# Altium schematic sheet MicroSDcard.SchDoc
size A4; SheetNumber: 6; SheetTotal: 13
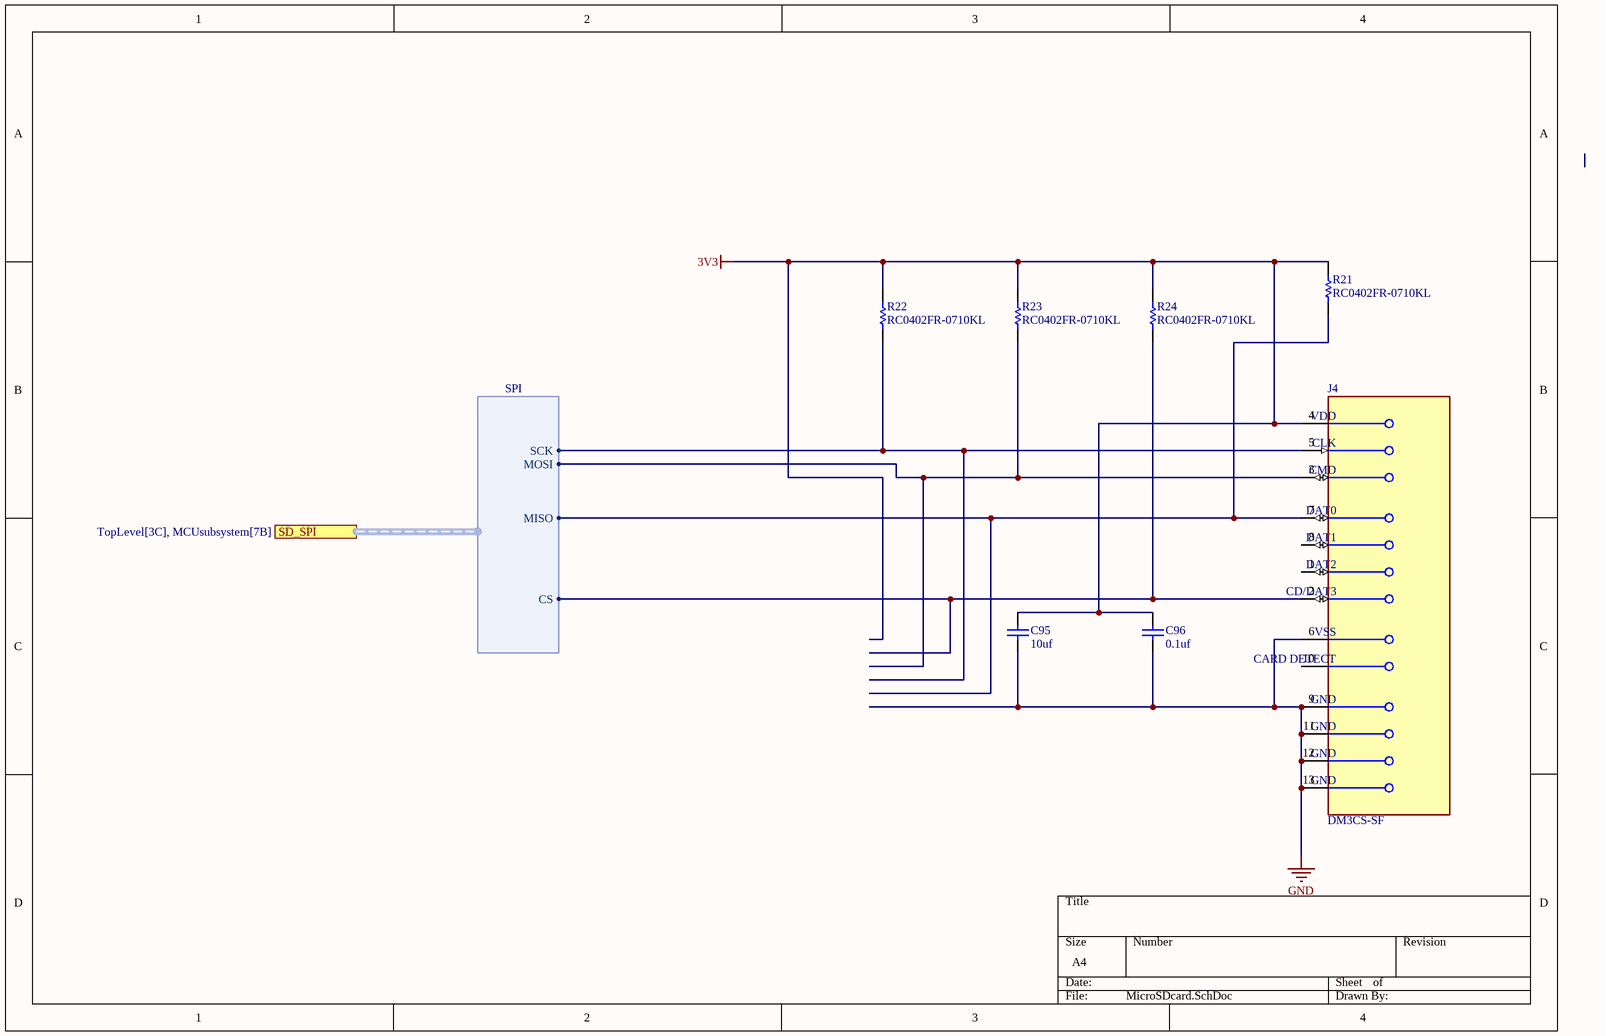
[diagram p0: MicroSDcard.SchDoc]

## Parts
C95  10uf  [CAPC1005X56X25NL10T15]
C96  0.1uf  [CAPC1608X90X35LL15T15]
J4  DM3CS-SF  [FP-DM3CS-SF-MFG]
R21  RC0402FR-0710KL  [RESC1005X40X25LL05T10]
R22  RC0402FR-0710KL  [RESC1005X40X25LL05T10]
R23  RC0402FR-0710KL  [RESC1005X40X25LL05T10]
R24  RC0402FR-0710KL  [RESC1005X40X25LL05T10]

## Ports
SD_SPI (harness SPI, see TopLevel[3C], MCUsubsystem[7B])

## Harnesses
SPI: SCK, MISO, MOSI, CS

## Nets
3V3: C95.1 C96.2 J4.4(VDD) R21.2 R22.2 R23.2 R24.2
GND: C95.2 C96.1 J4.6(VSS) J4.9(GND) J4.11(GND) J4.12(GND) J4.13(GND)
NetJ4_2: J4.2(CD/DAT3) R24.1 ; port SD_SPI.CS
NetJ4_3: J4.3(CMD) R23.1 ; port SD_SPI.MOSI
NetJ4_5: J4.5(CLK) R22.1 ; port SD_SPI.SCK
NetJ4_7: J4.7(DAT0) R21.1 ; port SD_SPI.MISO

Not connected (* = marked no-connect by the designer): J4 1(DAT2) 8(DAT1) 10(CARD_DETECT)

## Library data of the parts
C95 = CMP-2008-02890-1: Part Number: 0402ZD225MAT2A; Manufacturer: AVX Interconnect / Elco
C96 = CMP-2006-04199-2: Chip Capacitor, 100 nF, 25 V, -30 to 85 degC, 0603 (1608 Metric), RoHS, Tape and Reel; Manufacturer: AVX; Dielectric: Y5V; Rated Voltage: 25V; Tolerance (%): -20to+80%; Capacitance: 100nF; Datasheet Version: 01/2010; Package Description: 2-Pin Surface Mount Device, Body 1.6 x 0.8 mm; Manufacturer URL: http://www.avx.com/; Datasheet URL: http://datasheet.octopart.com/06033G104ZAT2A-AVX-datasheet-8445862.pdf; Package Reference: 0603; Case Size/Dimension: 0603; Mounting Technology: SurfaceMount
J4 = CMP-11597-000003-1: CONN MICRO SD CARD HINGED TYPE; Pitch: 1.1mm; Connector Type: Connector; Current Rating: 500mA; Voltage Rating (AC): 125V; Gender: Female; Insulation Resistance: 1GR; Number of Positions: 8; Contact Resistance: 100mR; Packaging: Tape and Reel; Flammability Rating: UL94 V-0; Lead Free: Lead Free; Min Operating Temperature: -25°C; Orientation: Right Angle; Width: 13.8mm; Number of Rows: 1; Housing Material: Polymer; Package Quantity: 1; Mount: Surface Mount; Max Current Rating: 500mA; Radiation Hardening: No; Max Operating Temperature: 85°C; Contact Plating: Gold; Depth: 1.83mm; Contact Material: Gold; Length: 14.1mm; Number of Contacts: 8; Termination: Solder
R21-R24 = CMP-2002-07353-1: Manufacturer: Yageo / Phycomp; Part Number: RC0402FR-0710KL